# Altium schematic sheet ethusb.SchDoc
size A
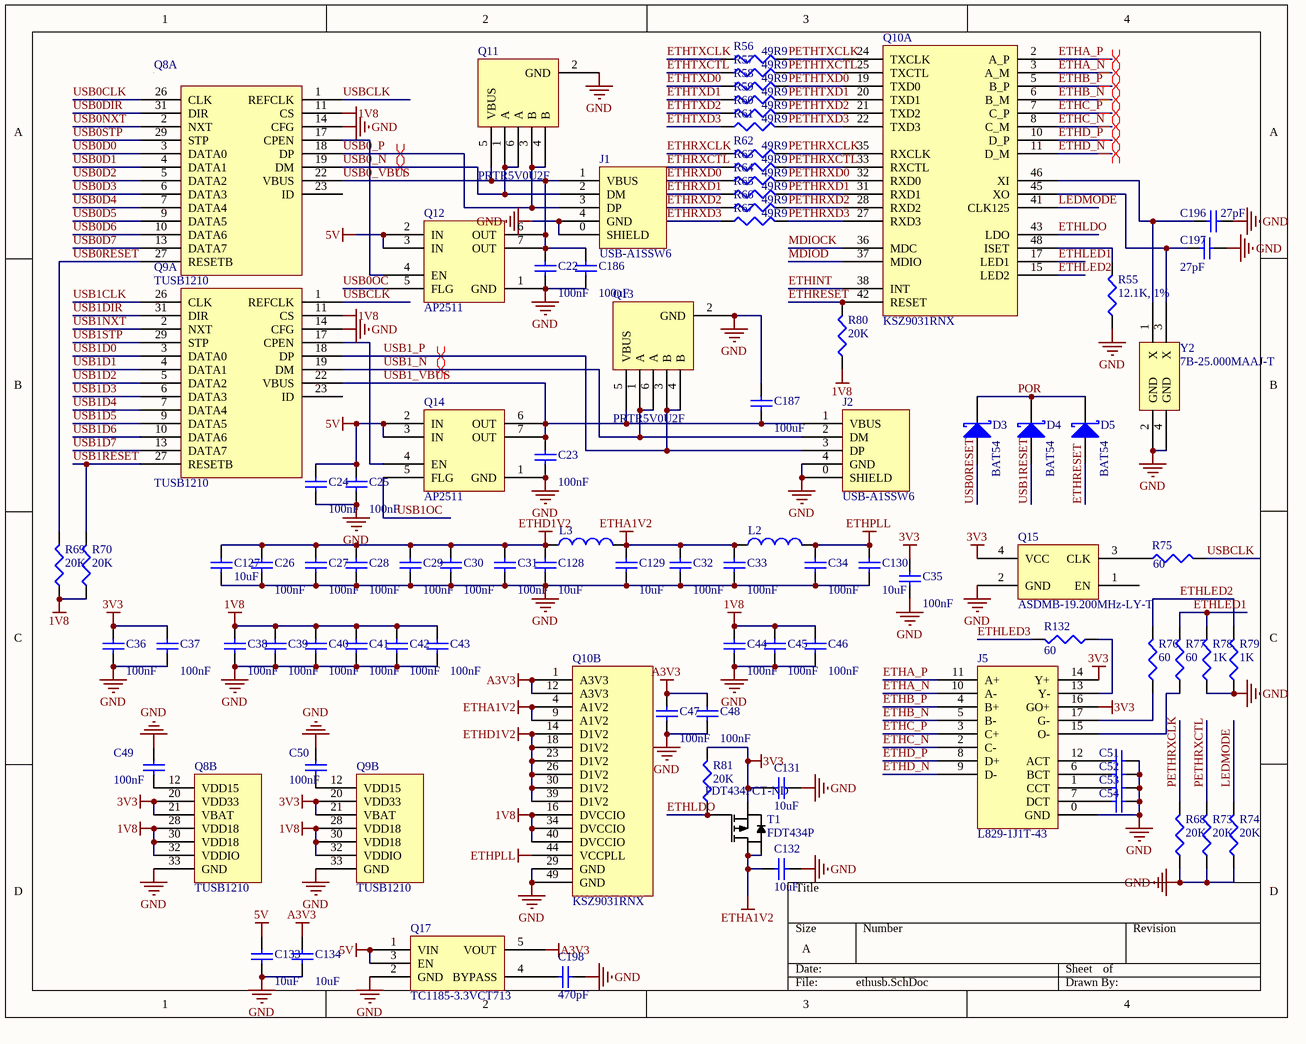
[diagram p0: ethusb.SchDoc]

## Parts
C22  value 100nF  [CAPC1005X06L]  (hidden comment: Cap)
C23  value 100nF  [CAPC1005X06L]  (hidden comment: Cap)
C24  value 100nF  [CAPC1005X06L]  (hidden comment: Cap)
C25  value 100nF  [CAPC1005X06L]  (hidden comment: Cap)
C26  value 100nF  [CAPC1005X06L]  (hidden comment: Cap)
C27  value 100nF  [CAPC1005X06L]  (hidden comment: Cap)
C28  value 100nF  [CAPC1005X06L]  (hidden comment: Cap)
C29  value 100nF  [CAPC1005X06L]  (hidden comment: Cap)
C30  value 100nF  [CAPC1005X06L]  (hidden comment: Cap)
C31  value 100nF  [CAPC1005X06L]  (hidden comment: Cap)
C32  value 100nF  [CAPC1005X06L]  (hidden comment: Cap)
C33  value 100nF  [CAPC1005X06L]  (hidden comment: Cap)
C34  value 100nF  [CAPC1005X06L]  (hidden comment: Cap)
C35  value 100nF  [CAPC1005X06L]  (hidden comment: Cap)
C36  value 100nF  [CAPC1005X06L]  (hidden comment: Cap)
C37  value 100nF  [CAPC1005X06L]  (hidden comment: Cap)
C38  value 100nF  [CAPC1005X06L]  (hidden comment: Cap)
C39  value 100nF  [CAPC1005X06L]  (hidden comment: Cap)
C40  value 100nF  [CAPC1005X06L]  (hidden comment: Cap)
C41  value 100nF  [CAPC1005X06L]  (hidden comment: Cap)
C42  value 100nF  [CAPC1005X06L]  (hidden comment: Cap)
C43  value 100nF  [CAPC1005X06L]  (hidden comment: Cap)
C44  value 100nF  [CAPC1005X06L]  (hidden comment: Cap)
C45  value 100nF  [CAPC1005X06L]  (hidden comment: Cap)
C46  value 100nF  [CAPC1005X06L]  (hidden comment: Cap)
C47  value 100nF  [CAPC1005X06L]  (hidden comment: Cap)
C48  value 100nF  [CAPC1005X06L]  (hidden comment: Cap)
C49  value 100nF  [CAPC1005X06L]  (hidden comment: Cap)
C50  value 100nF  [CAPC1005X06L]  (hidden comment: Cap)
C51  Cap  [CAPC1005X06L]  (value not drawn)
C52  Cap  [CAPC1005X06L]  (value not drawn)
C53  Cap  [CAPC1005X06L]  (value not drawn)
C54  Cap  [CAPC1005X06L]  (value not drawn)
C127  value 10uF  [CAPC1608X90N]  (hidden comment: GRM188R60G106ME47)
C128  value 10uF  [CAPC1608X90N]  (hidden comment: GRM188R60G106ME47)
C129  value 10uF  [CAPC1608X90N]  (hidden comment: GRM188R60G106ME47)
C130  value 10uF  [CAPC1608X90N]  (hidden comment: GRM188R60G106ME47)
C131  value 10uF  [CAPC1608X90N]  (hidden comment: GRM188R60G106ME47)
C132  value 10uF  [CAPC1608X90N]  (hidden comment: GRM188R60G106ME47)
C133  value 10uF  [CAPC1608X90N]  (hidden comment: GRM188R60G106ME47)
C134  value 10uF  [CAPC1608X90N]  (hidden comment: GRM188R60G106ME47)
C186  value 100uF  [CAPC3225X220N]  (hidden comment: GRM31CR60J107ME39L)
C187  value 100uF  [CAPC3225X220N]  (hidden comment: GRM31CR60J107ME39L)
C196  value 27pF  [CAPC1608X90N]  (hidden comment: CL10C270JB8NNNC)
C197  value 27pF  [CAPC1608X90N]  (hidden comment: CL10C270JB8NNNC)
C198  value 470pF  [CAPC1608X90N]  (hidden comment: CL10C471JB8NCNC)
D3  BAT54  [BAT54]
D4  BAT54  [BAT54]
D5  BAT54  [BAT54]
J1  USB-A1SSW6  [USB-A1SSW6]
J2  USB-A1SSW6  [USB-A1SSW6]
J5  L829-1J1T-43  [ETH-L829-1J1T-43]
L2  BLM18SG121TN1  [CAPC1608X90N]  (value not drawn)
L3  BLM18SG121TN1  [CAPC1608X90N]  (value not drawn)
Q8  TUSB1210  [QFN50P500X500X80_HS-33N]  (parts A,B of 2)
Q9  TUSB1210  [QFN50P500X500X80_HS-33N]  (parts A,B of 2)
Q10  KSZ9031RNX  (parts A,B of 2)
Q11  PRTR5V0U2F  [SOT886]
Q12  AP2511  [SOIC127P600X175-8AN]
Q13  PRTR5V0U2F  [SOT886]
Q14  AP2511  [SOIC127P600X175-8AN]
Q15  ASDMB-19.200MHz-LY-T  [ASDMB]
Q17  TC1185-3.3VCT713  [SOT23-5]
R55  value 12.1K, 1%  [J1-0603]  (hidden comment: RC1608F1212CS)
R56  value 49R9  [CAPC1005X06L]  (hidden comment: RC1005F49R9CS)
R57  value 49R9  [CAPC1005X06L]  (hidden comment: RC1005F49R9CS)
R58  value 49R9  [CAPC1005X06L]  (hidden comment: RC1005F49R9CS)
R59  value 49R9  [CAPC1005X06L]  (hidden comment: RC1005F49R9CS)
R60  value 49R9  [CAPC1005X06L]  (hidden comment: RC1005F49R9CS)
R61  value 49R9  [CAPC1005X06L]  (hidden comment: RC1005F49R9CS)
R62  value 49R9  [CAPC1005X06L]  (hidden comment: RC1005F49R9CS)
R63  value 49R9  [CAPC1005X06L]  (hidden comment: RC1005F49R9CS)
R64  value 49R9  [CAPC1005X06L]  (hidden comment: RC1005F49R9CS)
R65  value 49R9  [CAPC1005X06L]  (hidden comment: RC1005F49R9CS)
R66  value 49R9  [CAPC1005X06L]  (hidden comment: RC1005F49R9CS)
R67  value 49R9  [CAPC1005X06L]  (hidden comment: RC1005F49R9CS)
R68  value 20K  [J1-0603]  (hidden comment: RC1608F203CS)
R69  value 20K  [J1-0603]  (hidden comment: RC1608F203CS)
R70  value 20K  [J1-0603]  (hidden comment: RC1608F203CS)
R73  value 20K  [J1-0603]  (hidden comment: RC1608F203CS)
R74  value 20K  [J1-0603]  (hidden comment: RC1608F203CS)
R75  value 60  [J1-0603]  (hidden comment: RC1608F60R4CS)
R76  value 60  [J1-0603]  (hidden comment: RC1608F60R4CS)
R77  value 60  [J1-0603]  (hidden comment: RC1608F60R4CS)
R78  value 1K  [J1-0603]  (hidden comment: RC1608J102CS)
R79  value 1K  [J1-0603]  (hidden comment: RC1608J102CS)
R80  value 20K  [J1-0603]  (hidden comment: RC1608F203CS)
R81  value 20K  [J1-0603]  (hidden comment: RC1608F203CS)
R132  value 60  [J1-0603]  (hidden comment: RC1608F60R4CS)
T1  FDT434P  Supplier Part Number 1: FDT434PCT-ND
Y2  7B-25.000MAAJ-T  [XTAL]

## Nets
1V8: C38.2 C39.2 C40.2 C41.2 C42.2 C43.2 C44.2 C45.2 C46.2 Q8.11(CS) Q8.28(VDD18) Q8.30(VDD18) Q8.32(VDDIO) Q9.11(CS) Q9.28(VDD18) Q9.30(VDD18) Q9.32(VDDIO) Q10.16(DVCCIO) Q10.34(DVCCIO) Q10.40(DVCCIO) R69.1 R70.1 R80.1
3V3: C35.2 C36.2 C37.2 C131.2 J5.14(Y+) J5.16(GO+) Q8.20(VDD33) Q8.21(VBAT) Q9.20(VDD33) Q9.21(VBAT) Q15.4(VCC) R81.2 T1.3(S)
5V: C24.2 C25.2 C133.2 Q12.2(IN) Q12.3(IN) Q14.2(IN) Q14.3(IN) Q17.1(VIN) Q17.3(EN)
A3V3: C47.2 C48.2 C134.2 Q10.1(A3V3) Q10.12(A3V3) Q17.5(VOUT)
ETHA1V2: C32.2 C33.2 C129.2 C132.2 L2.1 L3.2 Q10.4(A1V2) Q10.9(A1V2) T1.2(D) T1.4(D)
ETHD1V2: C26.2 C27.2 C28.2 C29.2 C30.2 C31.2 C127.1 C128.2 L3.1 Q10.14(D1V2) Q10.18(D1V2) Q10.23(D1V2) Q10.26(D1V2) Q10.30(D1V2) Q10.39(D1V2)
ETHPLL: C34.2 C130.2 L2.2 Q10.44(VCCPLL)
GND: C22.1 C23.1 C24.1 C25.1 C26.1 C27.1 C28.1 C29.1 C30.1 C31.1 C32.1 C33.1 C34.1 C35.1 C36.1 C37.1 C38.1 C39.1 C40.1 C41.1 C42.1 C43.1 C44.1 C45.1 C46.1 C47.1 C48.1 C49.2 C50.1 C51.1 C52.1 C53.1 C54.1 C127.2 C128.1 C129.1 C130.1 C131.1 C132.1 C133.1 C134.1 C186.1 C187.2 C196.1 C197.1 C198.1 J1.0(SHIELD) J1.4(GND) J2.0(SHIELD) J2.4(GND) J5.0(GND) Q8.14(CFG) Q8.33(GND) Q9.14(CFG) Q9.33(GND) Q10.29(GND) Q10.49(GND) Q11.2(GND) Q12.1(GND) Q13.2(GND) Q14.1(GND) Q15.2(GND) Q17.2(GND) R55.1 R68.1 R73.1 R74.1 R78.1 R79.1 Y2.2(GND) Y2.4(GND)
ETHA_N: J5.10(A-) Q10.3(A_M)
ETHA_P: J5.11(A+) Q10.2(A_P)
ETHB_N: J5.5(B-) Q10.6(B_M)
ETHB_P: J5.4(B+) Q10.5(B_P)
ETHC_N: J5.2(C-) Q10.8(C_M)
ETHC_P: J5.3(C+) Q10.7(C_P)
ETHD_N: J5.9(D-) Q10.11(D_M)
ETHD_P: J5.8(D+) Q10.10(D_P)
ETHINT: Q10.38(INT)
ETHLDO: Q10.43(LDO) R81.1 T1.1(G)
ETHLED1: Q10.17(LED1) R77.2 R78.2
ETHLED2: Q10.15(LED2) R76.2 R79.2
ETHLED3: R132.2
ETHRESET: D5.1(A) Q10.42(RESET) R80.2
ETHRXCLK: R62.1
ETHRXCTL: R63.1
ETHRXD0: R64.1
ETHRXD1: R65.1
ETHRXD2: R66.1
ETHRXD3: R67.1
ETHTXCLK: R56.1
ETHTXCTL: R57.1
ETHTXD0: R58.1
ETHTXD1: R59.1
ETHTXD2: R60.1
ETHTXD3: R61.1
LEDMODE: Q10.41(CLK125) R74.2
MDIOCK: Q10.36(MDC)
MDIOD: Q10.37(MDIO)
PETHRXCLK: Q10.35(RXCLK) R62.2 R68.2
PETHRXCTL: Q10.33(RXCTL) R63.2 R73.2
PETHRXD0: Q10.32(RXD0) R64.2
PETHRXD1: Q10.31(RXD1) R65.2
PETHRXD2: Q10.28(RXD2) R66.2
PETHRXD3: Q10.27(RXD3) R67.2
PETHTXCLK: Q10.24(TXCLK) R56.2
PETHTXCTL: Q10.25(TXCTL) R57.2
PETHTXD0: Q10.19(TXD0) R58.2
PETHTXD1: Q10.20(TXD1) R59.2
PETHTXD2: Q10.21(TXD2) R60.2
PETHTXD3: Q10.22(TXD3) R61.2
POR: D3.2(K) D4.2(K) D5.2(K)
USB0_N: J1.2(DM) Q8.19(DM) Q11.1(A) Q11.6(A)
USB0_P: J1.3(DP) Q8.18(DP) Q11.3(B) Q11.4(B)
USB0_VBUS: C22.2 C186.2 J1.1(VBUS) Q8.22(VBUS) Q11.5(VBUS) Q12.6(OUT) Q12.7(OUT)
USB0CLK: Q8.26(CLK)
USB0D0: Q8.3(DATA0)
USB0D1: Q8.4(DATA1)
USB0D2: Q8.5(DATA2)
USB0D3: Q8.6(DATA3)
USB0D4: Q8.7(DATA4)
USB0D5: Q8.9(DATA5)
USB0D6: Q8.10(DATA6)
USB0D7: Q8.13(DATA7)
USB0DIR: Q8.31(DIR)
USB0NXT: Q8.2(NXT)
USB0OC: Q12.5(FLG)
USB0RESET: D3.1(A) Q8.27(RESETB) R69.2
USB0STP: Q8.29(STP)
USB1_N: J2.2(DM) Q9.19(DM) Q13.1(A) Q13.6(A)
USB1_P: J2.3(DP) Q9.18(DP) Q13.3(B) Q13.4(B)
USB1_VBUS: C23.2 C187.1 J2.1(VBUS) Q9.22(VBUS) Q13.5(VBUS) Q14.6(OUT) Q14.7(OUT)
USB1CLK: Q9.26(CLK)
USB1D0: Q9.3(DATA0)
USB1D1: Q9.4(DATA1)
USB1D2: Q9.5(DATA2)
USB1D3: Q9.6(DATA3)
USB1D4: Q9.7(DATA4)
USB1D5: Q9.9(DATA5)
USB1D6: Q9.10(DATA6)
USB1D7: Q9.13(DATA7)
USB1DIR: Q9.31(DIR)
USB1NXT: Q9.2(NXT)
USB1OC: Q14.5(FLG)
USB1RESET: D4.1(A) Q9.27(RESETB) R70.2
USB1STP: Q9.29(STP)
USBCLK: Q8.1(REFCLK) Q9.1(REFCLK) R75.2
NetC49_1: C49.1 Q8.12(VDD15)
NetC50_2: C50.2 Q9.12(VDD15)
NetC51_2: C51.2 J5.12(ACT)
NetC52_2: C52.2 J5.6(BCT)
NetC53_2: C53.2 J5.1(CCT)
NetC54_2: C54.2 J5.7(DCT)
NetC196_2: C196.2 Q10.46(XI) Y2.1(X)
NetC197_2: C197.2 Q10.45(XO) Y2.3(X)
NetC198_2: C198.2 Q17.4(BYPASS)
NetJ5_13: J5.13(Y-) R132.1
NetJ5_15: J5.15(O-) R77.1
NetJ5_17: J5.17(G-) R76.1
NetQ8_17: Q8.17(CPEN) Q12.4(EN)
NetQ9_17: Q9.17(CPEN) Q14.4(EN)
NetQ10_48: Q10.48(ISET) R55.2
NetQ15_3: Q15.3(CLK) R75.1

Not connected (* = marked no-connect by the designer): Q8 23(ID); Q9 23(ID); Q15 1(EN)

## Layout directives
differential pair: ETHA_N, ETHA_P, ETHB_N, ETHB_P, ETHC_N, ETHC_P, ETHD_N, ETHD_P, USB0_N, USB0_P, USB1_N, USB1_P

## Library data of the parts
C22-C50 C127-C134 C186 C187 C196-C198 = Cap: Capacitor; Published: 8-Jun-2000; LatestRevisionDate: 17-Jul-2002; LatestRevisionNote: Re-released for DXP Platform.; PackageReference: RAD-0.3; Publisher: Altium Limited; PackageDescription: Radial Cap, Thru-Hole; 2 Leads; 0.3 in Pin Spacing; Supplier 1: Digi-Key
  C22-C50: Supplier Part Number 1: 1276-1443-1-ND
  C127-C134: Supplier Part Number 1: 490-3298-1-ND
  C186 C187: Supplier Part Number 1: 490-4539-1-ND
  C196 C197: Supplier Part Number 1: 1276-1086-1-ND
  C198: Supplier Part Number 1: 1276-2302-1-ND
C51-C54 = Cap: Capacitor; Value: 100nF; Published: 8-Jun-2000; LatestRevisionDate: 17-Jul-2002; LatestRevisionNote: Re-released for DXP Platform.; PackageReference: RAD-0.3; Publisher: Altium Limited; PackageDescription: Radial Cap, Thru-Hole; 2 Leads; 0.3 in Pin Spacing; Supplier 1: Digi-Key; Supplier Part Number 1: 1276-1443-1-ND
D3-D5 = D Schottky: Schottky Diode; Published: 8-Jun-2000; LatestRevisionDate: 17-Jul-2002; LatestRevisionNote: Re-released for DXP Platform.; PackageReference: SMB; Publisher: Altium Limited; PackageDescription: DO-214-AA/SMB; 2 C-Bend Leads; Body 5.3 x 3.6 mm, inc. leads (LxW); Code_JEDEC: DO-214-AA; Supplier 1: Digi-Key; Supplier Part Number 1: BAT54FSCT-ND
J1 J2 = USB: Supplier 1: Digi-Key; Supplier Part Number 1: ED2991-ND
J5 = ETH: Supplier 1: Digi-Key; Supplier Part Number 1: 380-1110-ND
L2 L3 = Inductor: Code_IEC: 1005; Value: 10mH; Published: 8-Jun-2000; LatestRevisionDate: 29-May-2009; LatestRevisionNote: IPC-7351 Footprint Added.; PackageReference: 0402-A; Publisher: Altium Limited; PackageDescription: Chip Inductor; Code_JEITA: 0402; Supplier 1: Digi-Key; Supplier Part Number 1: 490-3996-1-ND
Q15 = osc: Supplier 1: Digi-Key; Supplier Part Number 1: 535-11184-1-ND
Q17 = LDO: Supplier 1: Digi-Key; Supplier Part Number 1: TC11853.3VCT713CT-ND
R55-R70 R73-R81 R132 = Res3: Resistor; Published: 8-Jun-2000; LatestRevisionDate: 29-May-2009; LatestRevisionNote: IPC-7351 Footprint Added.; PackageReference: J1-0603; PackageDescription: Chip Resistor; Supplier 1: Digi-Key
  R55: Publisher: Altium Limited; Supplier Part Number 1: 1276-4751-1-ND
  R56-R67: Publisher: Altium Limited; Supplier Part Number 1: 1276-3469-1-ND
  R68-R70 R73 R74: Publisher: Altium Limited; Supplier Part Number 1: 1276-4768-1-ND
  R75-R77 R132: Supplier Part Number 1: 1276-4547-1-ND
  R78 R79: Supplier Part Number 1: 1276-5062-1-ND
  R80 R81: Supplier Part Number 1: 1276-4768-1-ND
T1 = PMOS4: Supplier 1: Digi-Key
Y2 = XTAL: Supplier 1: Digi-Key; Supplier Part Number 1: 887-1112-1-ND
Q8 Q9 = TUSB1210: Supplier 1: Digi-Key; Supplier Part Number 1: 296-28384-1-ND
Q10 = KSZ9031RNX: Supplier 1: Digi-Key; Supplier Part Number 1: 576-4041-1-ND
Q11 Q13 = PRTR5V0U2F: Supplier 1: Digi-Key; Supplier Part Number 1: 568-4677-1-ND
Q12 Q14 = AP2511: Supplier 1: Digi-Key; Supplier Part Number 1: AP2511S-13DICT-ND